# Altium schematic sheet Rotary Switches.SchDoc
size A
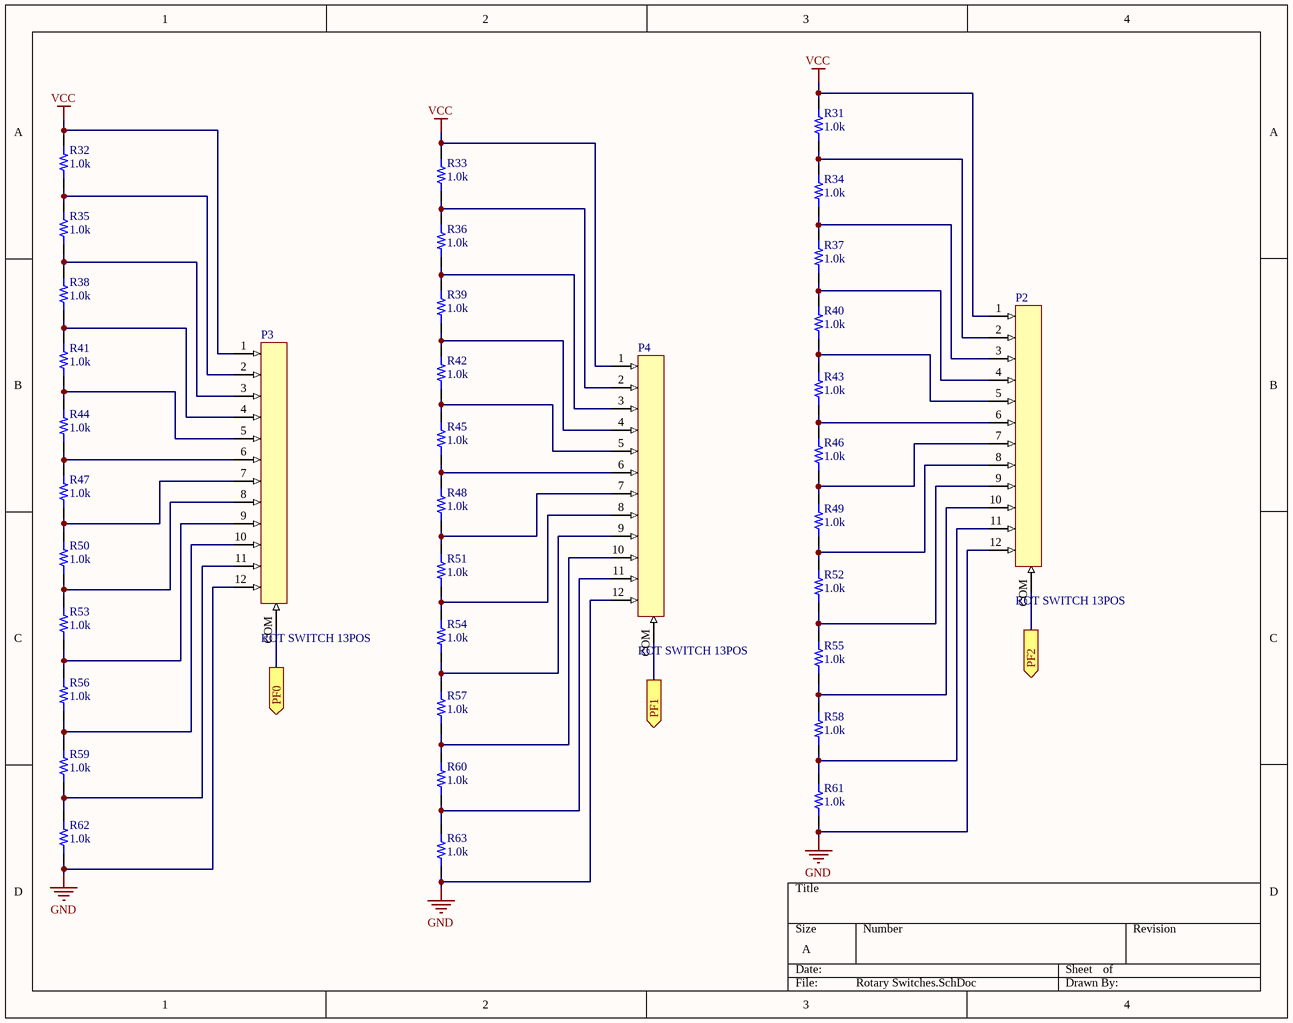
[diagram p0: Rotary Switches.SchDoc]

## Parts
P2  ROT SWITCH 13POS  [ROT SWITCH 13POS]
P3  ROT SWITCH 13POS  [ROT SWITCH 13POS]
P4  ROT SWITCH 13POS  [ROT SWITCH 13POS]
R31  value 1.0k  [RES 0603/1608]  (hidden comment: Resistor 1.0k 0603 1/10W 1%)
R32  value 1.0k  [RES 0603/1608]  (hidden comment: Resistor 1.0k 0603 1/10W 1%)
R33  value 1.0k  [RES 0603/1608]  (hidden comment: Resistor 1.0k 0603 1/10W 1%)
R34  value 1.0k  [RES 0603/1608]  (hidden comment: Resistor 1.0k 0603 1/10W 1%)
R35  value 1.0k  [RES 0603/1608]  (hidden comment: Resistor 1.0k 0603 1/10W 1%)
R36  value 1.0k  [RES 0603/1608]  (hidden comment: Resistor 1.0k 0603 1/10W 1%)
R37  value 1.0k  [RES 0603/1608]  (hidden comment: Resistor 1.0k 0603 1/10W 1%)
R38  value 1.0k  [RES 0603/1608]  (hidden comment: Resistor 1.0k 0603 1/10W 1%)
R39  value 1.0k  [RES 0603/1608]  (hidden comment: Resistor 1.0k 0603 1/10W 1%)
R40  value 1.0k  [RES 0603/1608]  (hidden comment: Resistor 1.0k 0603 1/10W 1%)
R41  value 1.0k  [RES 0603/1608]  (hidden comment: Resistor 1.0k 0603 1/10W 1%)
R42  value 1.0k  [RES 0603/1608]  (hidden comment: Resistor 1.0k 0603 1/10W 1%)
R43  value 1.0k  [RES 0603/1608]  (hidden comment: Resistor 1.0k 0603 1/10W 1%)
R44  value 1.0k  [RES 0603/1608]  (hidden comment: Resistor 1.0k 0603 1/10W 1%)
R45  value 1.0k  [RES 0603/1608]  (hidden comment: Resistor 1.0k 0603 1/10W 1%)
R46  value 1.0k  [RES 0603/1608]  (hidden comment: Resistor 1.0k 0603 1/10W 1%)
R47  value 1.0k  [RES 0603/1608]  (hidden comment: Resistor 1.0k 0603 1/10W 1%)
R48  value 1.0k  [RES 0603/1608]  (hidden comment: Resistor 1.0k 0603 1/10W 1%)
R49  value 1.0k  [RES 0603/1608]  (hidden comment: Resistor 1.0k 0603 1/10W 1%)
R50  value 1.0k  [RES 0603/1608]  (hidden comment: Resistor 1.0k 0603 1/10W 1%)
R51  value 1.0k  [RES 0603/1608]  (hidden comment: Resistor 1.0k 0603 1/10W 1%)
R52  value 1.0k  [RES 0603/1608]  (hidden comment: Resistor 1.0k 0603 1/10W 1%)
R53  value 1.0k  [RES 0603/1608]  (hidden comment: Resistor 1.0k 0603 1/10W 1%)
R54  value 1.0k  [RES 0603/1608]  (hidden comment: Resistor 1.0k 0603 1/10W 1%)
R55  value 1.0k  [RES 0603/1608]  (hidden comment: Resistor 1.0k 0603 1/10W 1%)
R56  value 1.0k  [RES 0603/1608]  (hidden comment: Resistor 1.0k 0603 1/10W 1%)
R57  value 1.0k  [RES 0603/1608]  (hidden comment: Resistor 1.0k 0603 1/10W 1%)
R58  value 1.0k  [RES 0603/1608]  (hidden comment: Resistor 1.0k 0603 1/10W 1%)
R59  value 1.0k  [RES 0603/1608]  (hidden comment: Resistor 1.0k 0603 1/10W 1%)
R60  value 1.0k  [RES 0603/1608]  (hidden comment: Resistor 1.0k 0603 1/10W 1%)
R61  value 1.0k  [RES 0603/1608]  (hidden comment: Resistor 1.0k 0603 1/10W 1%)
R62  value 1.0k  [RES 0603/1608]  (hidden comment: Resistor 1.0k 0603 1/10W 1%)
R63  value 1.0k  [RES 0603/1608]  (hidden comment: Resistor 1.0k 0603 1/10W 1%)

## Ports
PF0 (out), PF1 (out), PF2 (out)

## Nets
GND: P2.12 P3.12 P4.12 R61.2 R62.2 R63.2
VCC: P2.1 P3.1 P4.1 R31.1 R32.1 R33.1
PF0: P3.COM ; port PF0
PF1: P4.COM ; port PF1
PF2: P2.COM ; port PF2
NetP2_2: P2.2 R31.2 R34.1
NetP2_3: P2.3 R34.2 R37.1
NetP2_4: P2.4 R37.2 R40.1
NetP2_5: P2.5 R40.2 R43.1
NetP2_6: P2.6 R43.2 R46.1
NetP2_7: P2.7 R46.2 R49.1
NetP2_8: P2.8 R49.2 R52.1
NetP2_9: P2.9 R52.2 R55.1
NetP2_10: P2.10 R55.2 R58.1
NetP2_11: P2.11 R58.2 R61.1
NetP3_2: P3.2 R32.2 R35.1
NetP3_3: P3.3 R35.2 R38.1
NetP3_4: P3.4 R38.2 R41.1
NetP3_5: P3.5 R41.2 R44.1
NetP3_6: P3.6 R44.2 R47.1
NetP3_7: P3.7 R47.2 R50.1
NetP3_8: P3.8 R50.2 R53.1
NetP3_9: P3.9 R53.2 R56.1
NetP3_10: P3.10 R56.2 R59.1
NetP3_11: P3.11 R59.2 R62.1
NetP4_2: P4.2 R33.2 R36.1
NetP4_3: P4.3 R36.2 R39.1
NetP4_4: P4.4 R39.2 R42.1
NetP4_5: P4.5 R42.2 R45.1
NetP4_6: P4.6 R45.2 R48.1
NetP4_7: P4.7 R48.2 R51.1
NetP4_8: P4.8 R51.2 R54.1
NetP4_9: P4.9 R54.2 R57.1
NetP4_10: P4.10 R57.2 R60.1
NetP4_11: P4.11 R60.2 R63.1

## Library data of the parts
P2-P4 = 2: Manufacturer_id: 1; MfrPartNo: 56DP30-01-1-AJN; idTable: 2; Name: Grayhill Single Deck Rotary Switch; Value: 200mA; Voltage_Rating: 115V; Num_Contacts: 13; Created_By: Angel; Drawer_id: 1; Link: https://www.digikey.com/product-detail/en/grayhill-inc/56DP30-01-1-AJN/GH7279-ND/483187; ComponentLink1Description: Datasheet; Created_Date: 10/27/2018
R31-R63 = 289: Manufacturer_id: 1; idResistor: 289; Name: Res_1.0k_0603_1/10W_1%; Created_By: Nick Mah; Supplier 1: Digi-Key; Drawer_id: 1; Tolerance: 1%; Power: 1/10W; Package: 0603; ComponentLink1Description: Datasheet; Created_Date: 2018-10-20